# Altium schematic sheet low pass filter.SchDoc
size A4
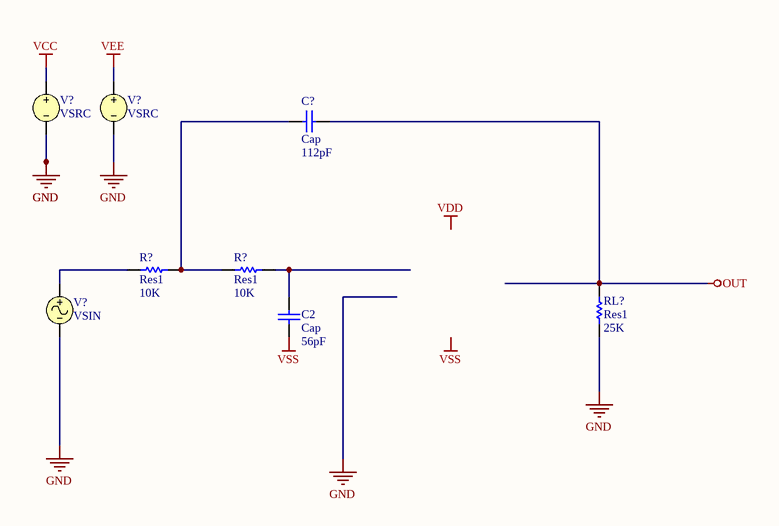
[diagram p0: low pass filter.SchDoc]

## Parts
(Parts that share a designator on the sheet are numbered #1, #2 ... from top to bottom, then left to right.)
C2  Cap  value 56pF  [RAD-0.3]
C?  Cap  value 112pF  [RAD-0.3]
R?#1  Res1  value 10K  [AXIAL-0.3]
R?#2  Res1  value 10K  [AXIAL-0.3]
RL?  Res1  value 25K  [AXIAL-0.3]
V?#1  VSRC
V?#2  VSRC
V?#3  VSIN

## Nets
GND: RL?.1 V?#1.2 V?#2.2 V?#3.2
OUT: C?.1 RL?.2
VCC: V?#1.1
VEE: V?#2.1
VSS: C2.1
NetC2_2: C2.2 R?#2.2
NetC?_2: C?.2 R?#1.2 R?#2.1
NetR?#1_1: R?#1.1 V?#3.1

## Notes on the sheet
- Labels drawn without touching a wire or pin: VDD, VSS

## Library data of the parts
C2 C? = Cap: Capacitor; Published: 8-Jun-2000; LatestRevisionDate: 17-Jul-2002; LatestRevisionNote: Re-released for DXP Platform.; PackageReference: RAD-0.3; Publisher: Altium Limited; PackageDescription: Radial Cap, Thru-Hole; 2 Leads; 0.3 in Pin Spacing
R?#1 R?#2 RL? = Res1: Resistor; Published: 8-Jun-2000; LatestRevisionDate: 17-Jul-2002; LatestRevisionNote: Re-released for DXP Platform.; PackageReference: AXIAL-0.3; Publisher: Altium Limited; PackageDescription: Axial Device, Thru-Hole; 2 Leads; 0.3 in Pin Spacing
V?#1 = VSRC: Voltage Source; Note: PCB Footprint - Not required; Value: 12V; Published: 8-Jun-2000; LatestRevisionDate: 17-Jul-2002; LatestRevisionNote: Re-released for DXP Platform.; PackageReference: Not Applicable; Publisher: Altium Limited
V?#2 = VSRC: Voltage Source; Note: PCB Footprint - Not required; Published: 8-Jun-2000; LatestRevisionDate: 17-Jul-2002; LatestRevisionNote: Re-released for DXP Platform.; PackageReference: Not Applicable; Publisher: Altium Limited
V?#3 = VSIN: Sinusoidal Voltage Source; Note: PCB Footprint - Not required; Published: 8-Jun-2000; LatestRevisionDate: 15-Nov-2004; LatestRevisionNote: Corrected Netlist.; PackageReference: Not Applicable; Publisher: Altium Limited